# EAGLE design QAn_IP5306_1_0 (EAGLE 6.6.0)
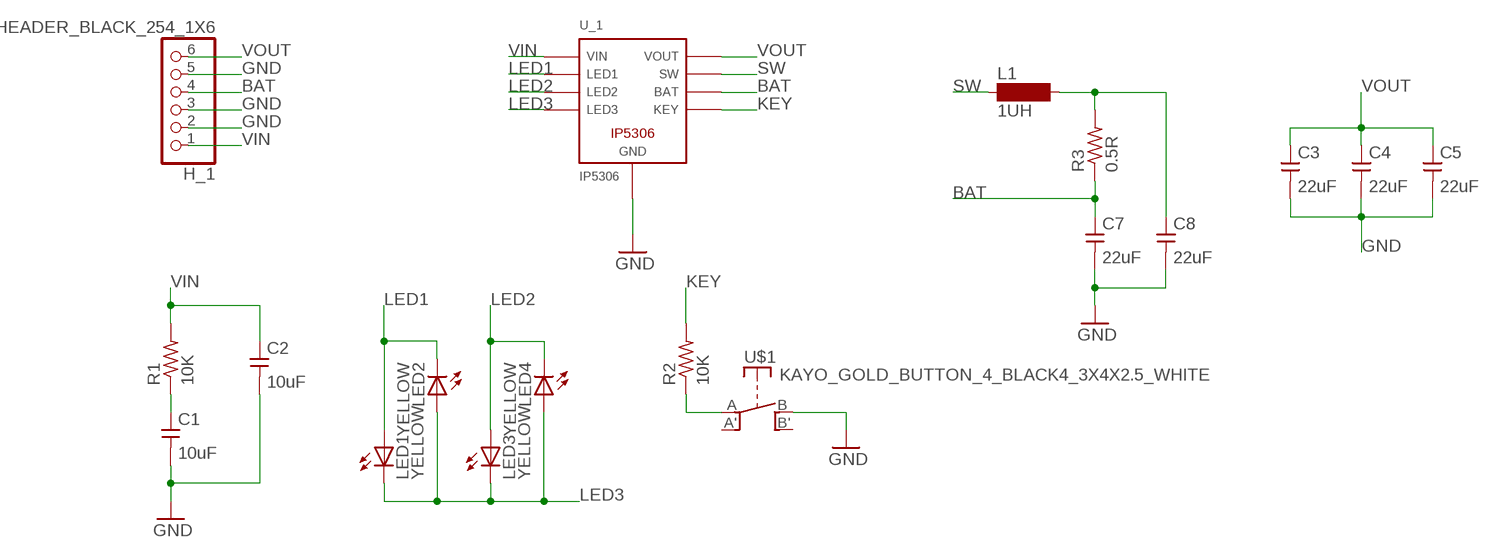
[diagram p0: schematic, sheet 1]

## Parts
C1  10uF  KAYO_CAP_CERAMIC10UF_1206  [C1206]
C2  10uF  KAYO_CAP_CERAMIC10UF_1206  [C1206]
C3  22uF  KAYO_CAP_CERAMIC10UF_1206  [C1206]
C4  22uF  KAYO_CAP_CERAMIC10UF_1206  [C1206]
C5  22uF  KAYO_CAP_CERAMIC22UF_KXN_0603  [KXN_C0603]
C7  22uF  KAYO_CAP_CERAMIC10UF_1206  [C1206]
C8  22uF  KAYO_CAP_CERAMIC10UF_1206  [C1206]
H_1  HEADER_BLACK_254_1X6  KXN_HEADER_1X6_M_LOCK  [HEADER_1X6_254_LOCK]
L1  1UH  INDUCTOR_FEEDER_KAYO_0630  [CKST_0603_0630_PACK]
LED1  YELLOW  KAYO_LED_YELLOW_KXN_LED_0603  [KXN_LED_0603]
LED2  YELLOW  KAYO_LED_YELLOW_KXN_LED_0603  [KXN_LED_0603]
LED3  YELLOW  KAYO_LED_YELLOW_KXN_LED_0603  [KXN_LED_0603]
LED4  YELLOW  KAYO_LED_YELLOW_KXN_LED_0603  [KXN_LED_0603]
R1  10K  R-US_10K_R0603_KXN  [R0603_KXN]
R2  10K  R-US_10K_R0603_KXN  [R0603_KXN]
R3  0.5R  R-US__R0603_KXN  [R0603_KXN]
U$1  KAYO_GOLD_BUTTON_4_BLACK4_3X4X2.5_WHITE  [KXN_BUTTON_3_4_2.5MM]
U_1  IP5306  IP5306_1  [ESOP8]

## Nets
BAT: C7.1(+) H_1.4 R3.1 U_1.6
GND: C1.2(-) C2.2(-) C3.2(-) C4.2(-) C5.2(-) C7.2(-) C8.2(-) H_1.2 H_1.3 H_1.5 U$1.B U_1.9
KEY: R2.2 U_1.5
LED1: LED1.A LED2.C U_1.2
LED2: LED3.A LED4.C U_1.3
LED3: LED1.C LED2.A LED3.C LED4.A U_1.4
N$1: C1.1(+) R1.1
N$4: R2.1 U$1.A
N$6: C8.1(+) L1.P$2 R3.2
SW: L1.P$1 U_1.7
VIN: C2.1(+) H_1.1 R1.2 U_1.1
VOUT: C3.1(+) C4.1(+) C5.1(+) H_1.6 U_1.8
Unconnected: U$1.A' U$1.B'

## Library data of the parts
C1 C2 = kxnStandard_capacitor:KAYO_CAP_CERAMIC; CC_SHOP: CongCo; INFO: C1206 10uF 25V
C3 C4 C7 C8 = kxnStandard_capacitor:KAYO_CAP_CERAMIC; CC_SHOP: CongCo; INFO: C1206 10uF 25V; VALUE: 10uF
C5 = kxnStandard_capacitor:KAYO_CAP_CERAMIC; CC_SHOP: CongCo; INFO: C0603 22uF 10V
H_1 = kxnStandard_connector:KXN_HEADER_1X6; CC_SHOP: CongCo
L1 = kxnStandard_inductor:INDUCTOR_FEEDER_KAYO: INDUCTOR SMD power inductor size: 4.6 x 4.1 x 2 (mm) https://item.taobao.com/item.htm?spm=a1z10.3-c-s.w4002-21223910208.37.43076a4bKJhobU&id=528437837997; INFO: L0630 47uH 3A
LED1-LED4 = kxnStandard_led:KAYO_LED: LED OSRAM: - CHIPLED LG R971, LG N971, LY N971, LG Q971, LY Q971, LO R971, LY R971 LH N974, LH R974 LS Q976, LO Q976, LY Q976 LO Q996 - Hyper CHIPLED LW Q18S LB Q993, LB Q99A, LB R99A - SideLED LS A670, LO A670, LY A670, LG A670, LP A670 LB A673, LV A673, LT A673, LW A673 LH A674 LY A675 LS A676, LA A676, LO A676, LY A676, LW A676 LS A679, LY A679, LG A679 - Hyper Micro SIDELED® LS Y876, LA Y876, LO Y876, LY Y876 LT Y87S - SmartLED LW L88C, LW L88S LB L89C, LB L89S, LG L890 LS L89K, LO L89K, LY L89K LS L896, LA L896, LO L896, LY L896 - TOPLED LS T670, LO T670, LY T670, LG T670, LP T670 LSG T670, LSP T670, LSY T670, LOP T670, LYG T670 LG T671, LOG T671, LSG T671 LB T673, LV T673, LT T673, LW T673 LH T674 LS T676, LA T676, LO T676, LY T676, LB T676, LH T676, LSB T676, LW T676 LB T67C, LV T67C, LT T67C, LS T67K, LO T67K, LY T67K, LW E67C LS E67B, LA E67B, LO E67B, LY E67B, LB E67C, LV E67C, LT E67C LW T67C LS T679, LY T679, LG T679 LS T770, LO T770, LY T770, LG T770, LP T770 LB T773, LV T773, LT T773, LW T773 LH T774 LS E675, LA E675, LY E675, LS T675 LS T776, LA T776, LO T776, LY T776, LB T776 LHGB T686 LT T68C, LB T68C - Hyper Mini TOPLED® LB M676 - Mini TOPLED Santana® LG M470 LS M47K, LO M47K, LY M47K Source: http://www.osram.convergy.de/; CC_COST: 0.045; CC_ID: 522554271548; CC_LINK: https://item.taobao.com/item.htm?id=522554271548&skuId=5766142345187; CC_OPTION: 0603_黄色(20只); CC_SHOP: CongCo; INFO: Led 0603 YELLOW; JLC_PART_COST: 0.0099; JLC_PART_ID: C2287; JLC_PART_LINK: https://jlcpcb.com/partdetail/Hubei_KentoElec-KT0603Y/C2287; KXN_ID: SA73414714
R1 R2 = kxnStandard_resistor:R-US_: RESISTOR, American symbol; CC_SHOP: CongCo; INFO: R0603 10K 1%
R3 = kxnStandard_resistor:R-US_: RESISTOR, American symbol; CC_SHOP: CongCo; INFO: R0603 2K 1%
U$1 = kxn_Standard_button_switch:KAYO_GOLD_BUTTON_4*4: Button size: 4*4*1.5 or 4*4*3 item.htm?id=557115198331 https://jlcpcb.com/partdetail/Alpsalpine-SKRPABE010/C115360 Button_3x4x2.5mm_SKRPABE010_datasheet.pdf; INFO: BUTTON 4P SMD 3*4*2.5
U_1 = kxnStandard_IC_Function:IP5306; CC_SHOP: CongCo

## Board
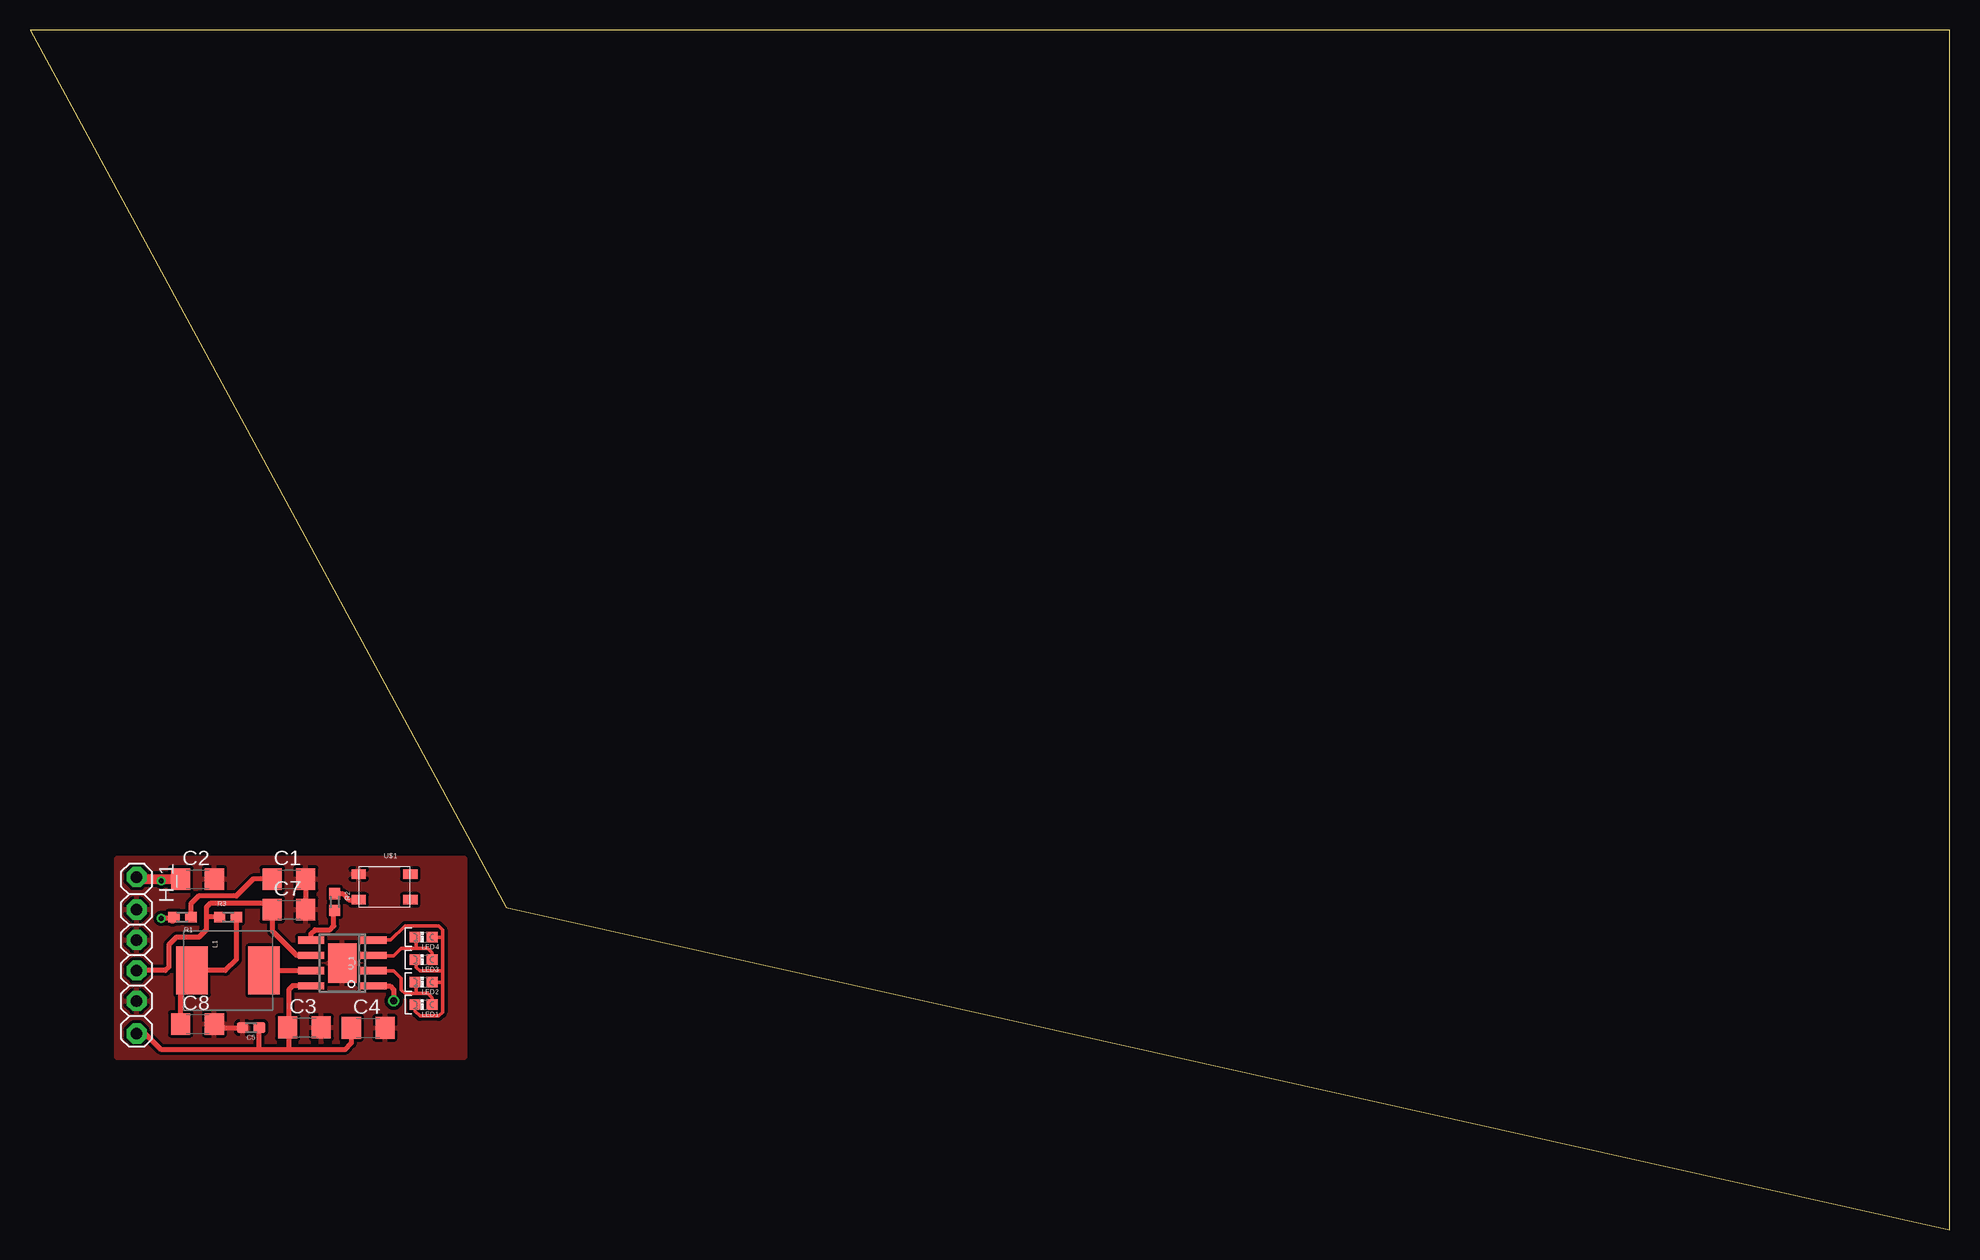
[diagram p1: board, top side]
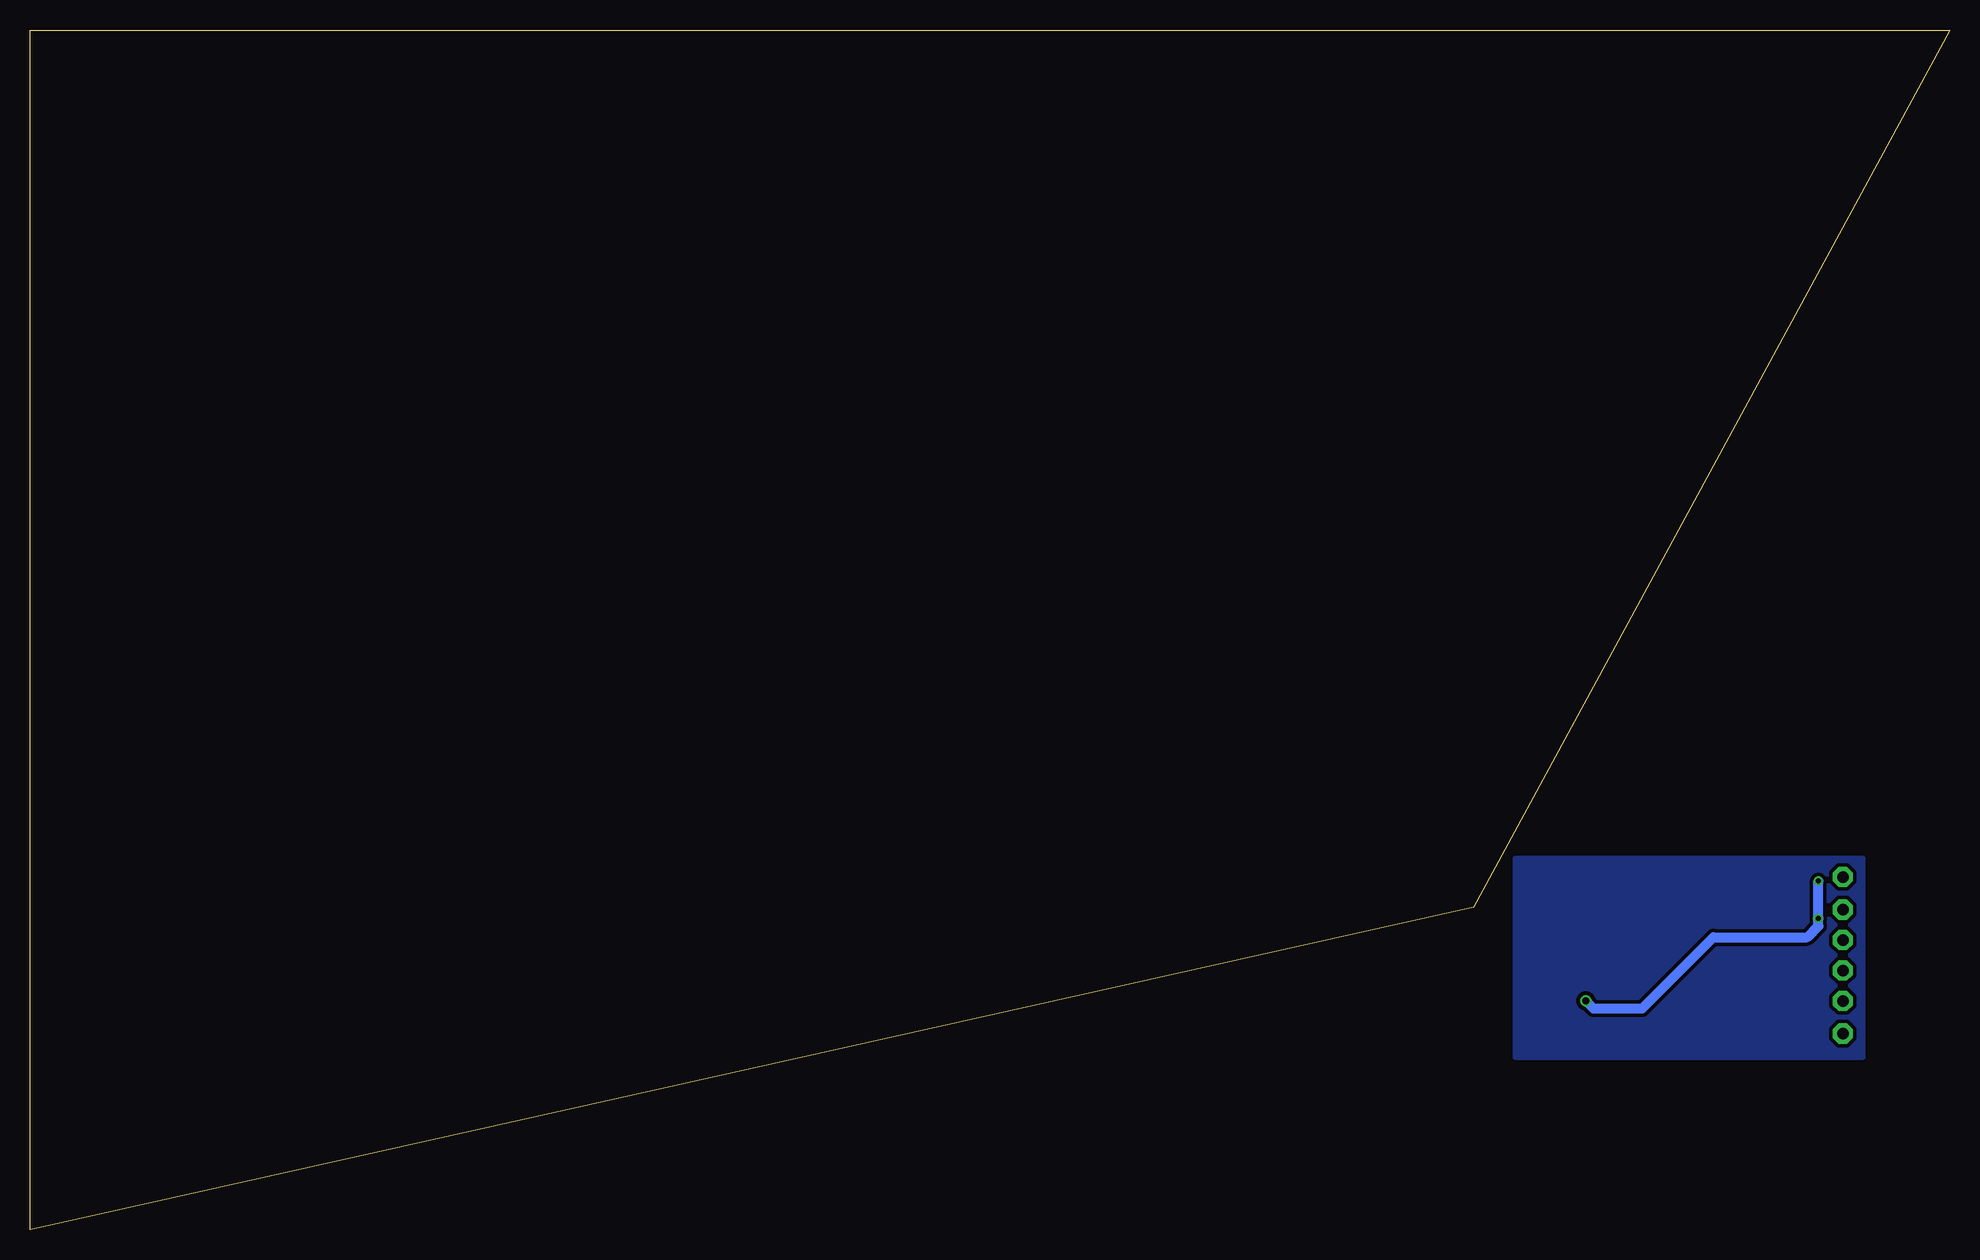
[diagram p2: board, bottom side, seen from below]

Size 160 x 100 mm. Coordinates in mm from the lower left corner, seen from the top.
Outline: 39.69,26.88 160,0 160,100 0,100 39.69,26.88
Copper layers (1*16): Top 0.035mm / dielectric 1.5mm / Bottom 0.035mm
Design rules "SparkFun-2-Layer-General-JLCPCB_kxnUsing": minimum track width 7mil, minimum drill 0.3mm, track to track 7mil, track to pad 7mil, pad to pad 7mil, via to via 7mil, smd to smd 7mil, copper to edge 7mil, drill to drill 7mil, minimum pad ring 7mil, minimum via ring 7mil, stop-mask expansion 0mil, vias tented up to drill 0.3mm, thermal gap 10mil

### Footprints (pad centres in the part's own frame; a part is rotated, then mirrored left to right if it is on the bottom)
C1206 = smd 1.6 x 1.8: 1 -1.4,0; 2 1.4,0
KXN_C0603 = smd 0.95 x 0.9: 1 -0.7,0; 2 0.7,0
HEADER_1X6_254_LOCK = drill 0.95 pad 1.676 octagon: 1 -6.53,0; 2 -3.81,0; 3 -1.27,0; 4 1.27,0; 5 3.81,0; 6 6.53,0
CKST_0603_0630_PACK = smd 2.63 x 4: P$1 -3,0; P$2 3,0
KXN_LED_0603 = smd 0.9 x 0.9: A 0.7,0; C -0.7,0
R0603_KXN = smd 0.95 x 0.9: 1 -0.7,0; 2 0.7,0
KXN_BUTTON_3_4_2.5MM = smd 1.2 x 0.8: A -2.15,-1.075; A' 2.15,-1.075; B -2.15,1.075; B' 2.15,1.075
ESOP8 = smd 0.6 x 2.2: 1 -1.905,-2.6; 2 -0.635,-2.6; 3 0.635,-2.6; 4 1.905,-2.6; 5 1.905,2.6; 6 0.635,2.6; 7 -0.635,2.6; 8 -1.905,2.6 | smd 3.3 x 2.4: 9 0,0

### Placement (x,y rotation side)
C1  21.59,29.21 0 top
C2  13.97,29.21 0 top
C3  22.88,16.85 0 top
C4  28.19,16.81 0 top
C5  18.43,16.82 180 top
C7  21.59,26.67 0 top
C8  13.97,17.14 0 top
H_1  8.89,22.86 270 top
L1  16.51,21.59 180 top
LED1  32.81,18.75 0 top
LED2  32.81,20.62 0 top
LED3  32.81,22.5 0 top
LED4  32.81,24.38 0 top
R1  12.7,26.05 180 top
R2  25.4,27.3 270 top
R3  16.51,26.05 0 top
U$1  29.54,28.57 0 top
U_1  26.04,22.23 90 top

### Tracks (layer width: path | path; a pad name or v marks a point on that pad's centre or on a via)
BAT
  Top 0.406: U_1.6 22.23,22.86 20.19,24.89 C7.1 19.67,27.19 15,27.19 14.69,26.88 14.69,25.94 | H_1.4 11.28,21.59 11.56,21.88 11.56,23.75 12.19,24.38 14.06,24.38 14.69,25 14.69,25.94 | R3.1 14.79,26.05 14.69,25.94
GND
  Top 0.406: 23.57,29.79 C1.2 C7.2 | C8.2 15.68,16.82 C5.2
  pour Top (isolate 0.254, rank 6): 9.69,30.94 7.19,30.94 7.19,14.38 36.25,14.38 36.25,30.94
KEY
  Top 0.406: U_1.5 23.43,24.68 23.75,25 25,25 25.31,25.31 25.31,26.52 R2.2
LED1
  Top 0.305: U_1.2 28.66,21.56 30.31,21.56 30.94,20.94 30.94,20 31.25,19.69 32.19,19.69 | 32.19,19.69 33.12,19.69 33.51,19.3 LED1.A | LED2.C 32.19,20.55 32.19,19.69
  Top 0.406: U_1.2 28.57,21.59
LED2
  Top 0.305: U_1.3 28.68,22.81 30.31,22.81 30.94,23.44 32.19,23.44 | 32.19,23.44 33.12,23.44 33.51,23.05 LED3.A | LED4.C 32.19,24.3 32.19,23.44
LED3
  Top 0.305: U_1.4 30.07,24.13 31.25,25.31 34.06,25.31 34.38,25 34.38,24.38 | 34.38,24.38 34.38,21.56 | 34.38,21.56 34.38,20.62 | 34.38,20.62 34.38,18.12 34.06,17.81 32.5,17.81 32.11,18.2 LED1.C | LED2.A 34.38,20.62 | LED4.A 34.38,24.38 | LED3.C 32.19,22.43 32.19,21.88 32.5,21.56 34.38,21.56
N$1
  Top 0.406: C1.1 18.59,29.21 17.19,27.81 14.06,27.81 13.4,27.15 R1.1
N$2
  pour Bottom (isolate 0.305, rank 6): 7.19,30.94 36.25,30.94 36.25,14.38 7.19,14.38
N$4
  Top 0.406: R2.1 26.06,28 26.56,27.5 U$1.A
N$6
  Top 0.406: C8.1 12.57,21.59 L1.P$2 16.28,21.59 17.19,22.5 17.19,26.02 R3.2
SW
  Top 0.406: L1.P$1 U_1.7
VIN  (via drill 0.4, 0.6)
  Top 0.406: H_1.1 9.07,29.21 | U_1.1 30,20.31 30.31,20 v30.31,19.06 | 11.89,25.94 v10.94,25.94 | 10.94,29.21 v10.94,29.06
  Top 0.813: 9.07,29.21 10.94,29.21 C2.1 | R1.2 11.89,25.94
  Bottom 0.813: v30.31,19.06 29.69,18.44 25.62,18.44 19.69,24.38 11.88,24.38 10.94,25.31 v10.94,25.94 v10.94,29.06
VOUT
  Top 0.406: 21.56,15 26.25,15 26.79,15.54 C4.1 | 21.56,15 19.06,15 | 19.06,15 10.94,15 9.61,16.33 H_1.6 | C5.1 19.06,16.76 19.06,15 | 21.56,15 21.56,16.77 C3.1 21.56,16.93 21.56,20 21.88,20.32 U_1.8